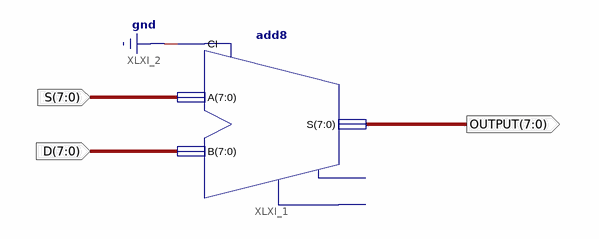
[diagram p0: schematic sheet 1]
// Xilinx ISE schematic ADD.sch (spartan6) as structural Verilog: 1 symbols, 3 ports
module ADD (
  input  [7:0] S,
  input  [7:0] D,
  output [7:0] OUTPUT
);

  add8 XLXI_1 (.A(S), .B(D), .CI(1'b0), .S(OUTPUT));  // open: CO, OFL
endmodule
